# Altium schematic sheet 21_GPIOs_EXP.SchDoc
size A3; SheetNumber: 22; SheetTotal: 22
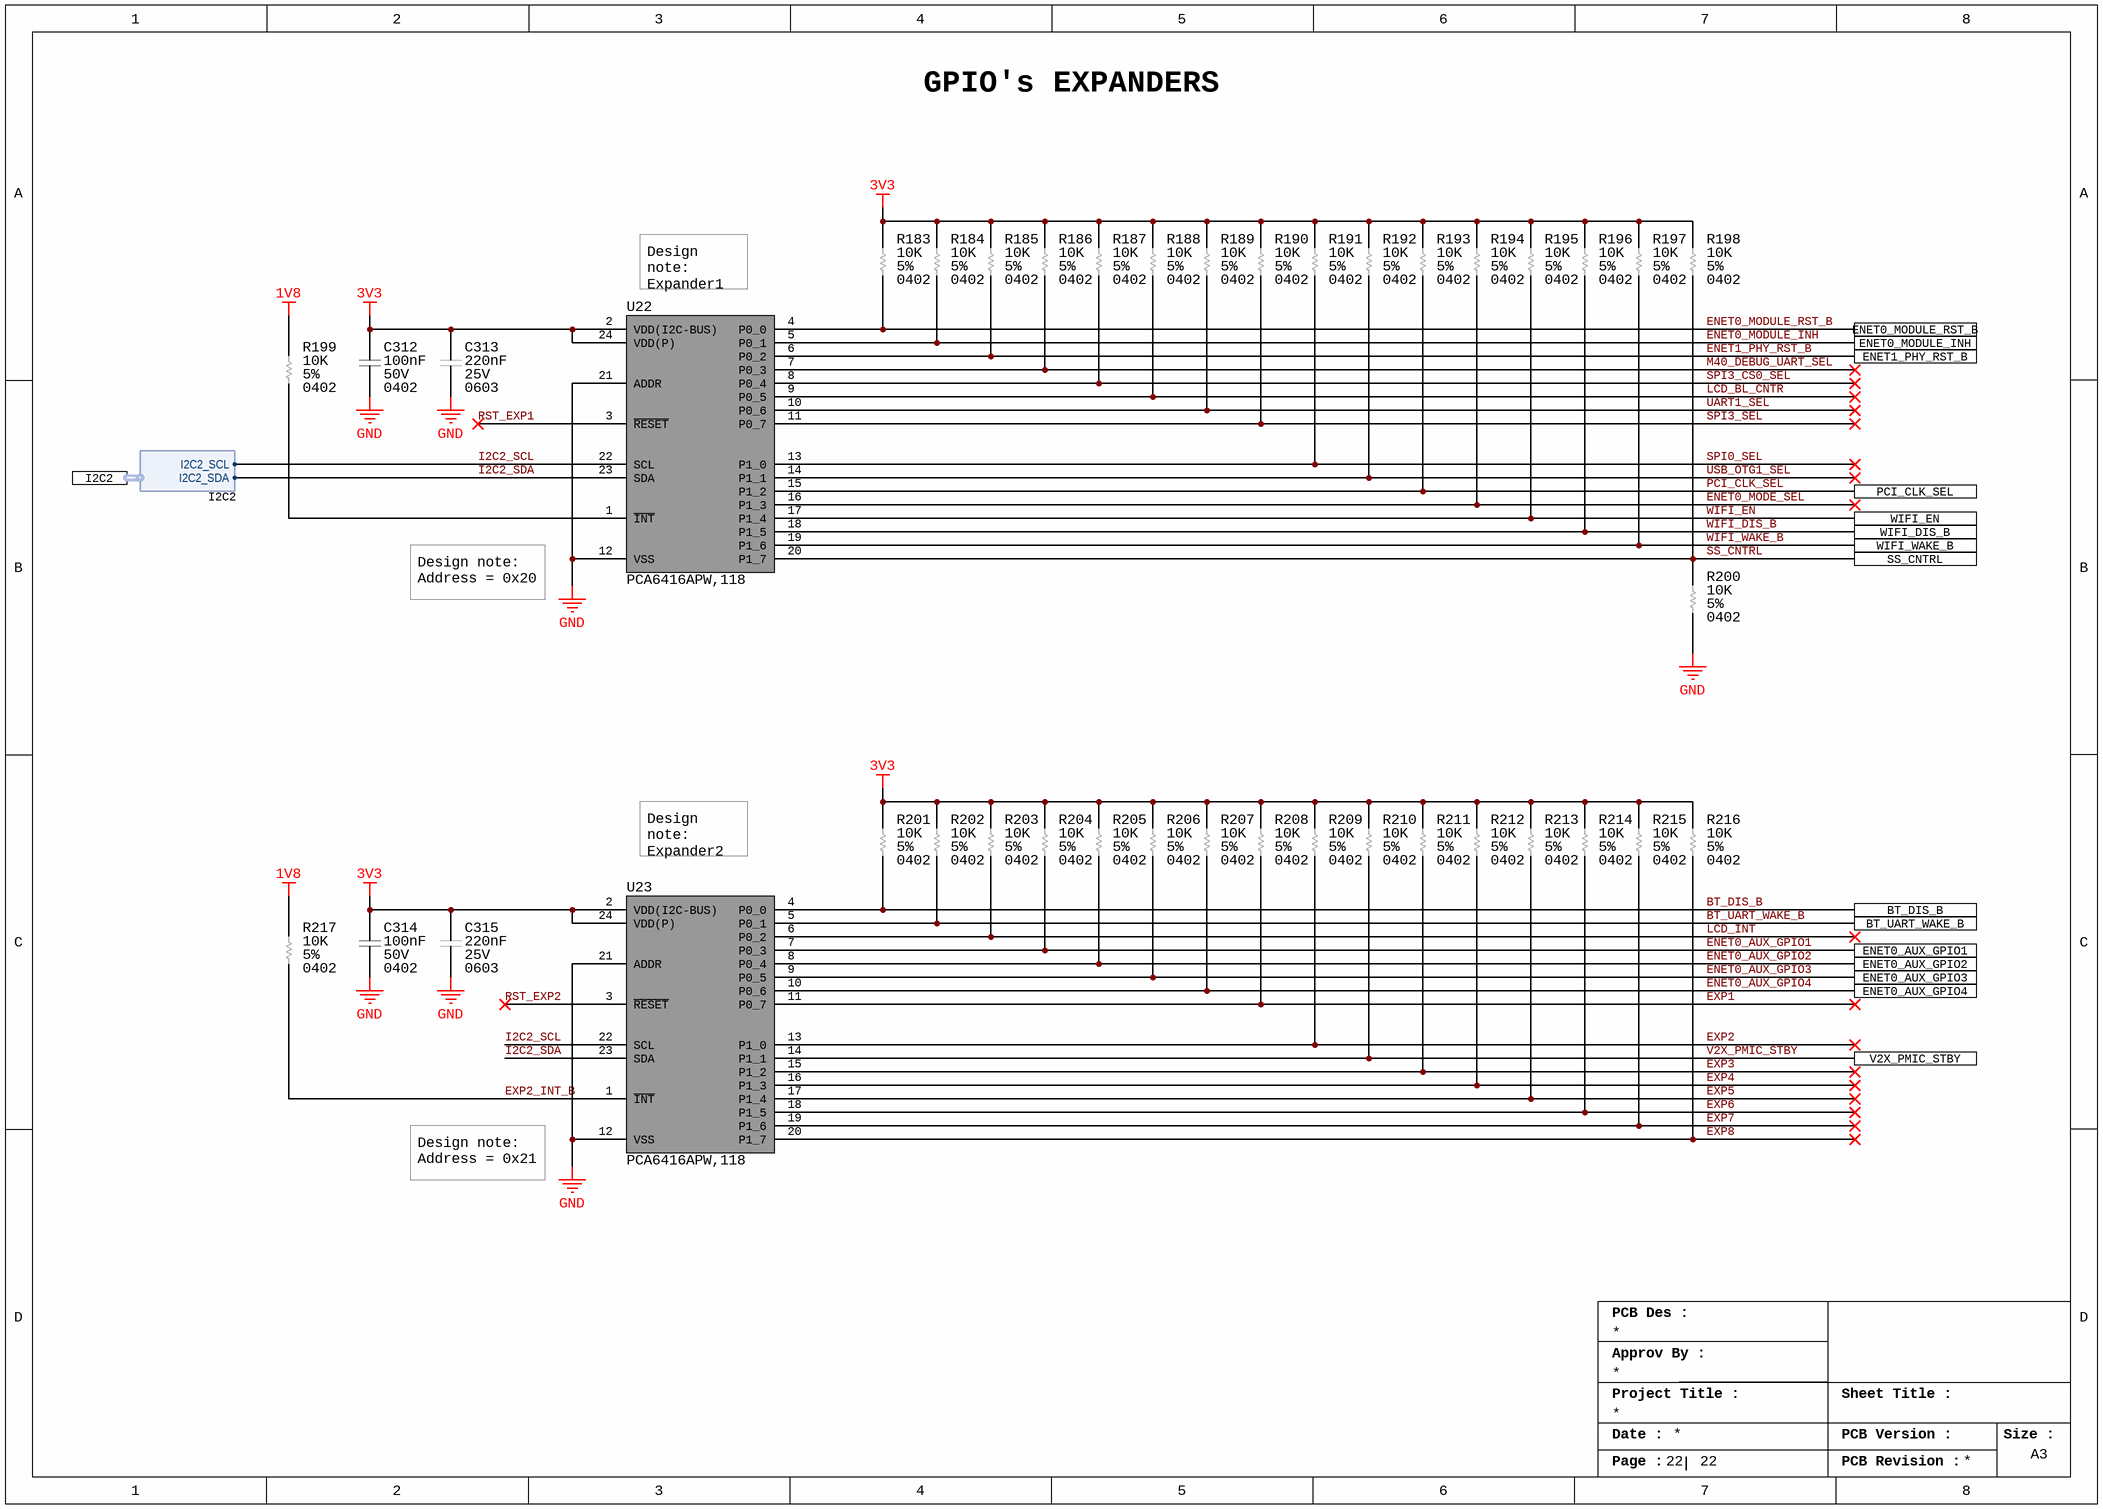
[diagram p0: 21_GPIOs_EXP.SchDoc]

## Parts
C312  Voltage Rating: 50V  Capacitance: 100nF  Case/Package: 0402  [CAP_0402_CAPC1005X05N]  (hidden comment: GRM155R71H104KE14D)
C313  Case/Package: 0603  Voltage Rating: 25V  Capacitance: 220nF  [CAP_0603_CAPC1608X08N]  (hidden comment: GRM188R71E224KA88D)
C314  Voltage Rating: 50V  Capacitance: 100nF  Case/Package: 0402  [CAP_0402_CAPC1005X05N]  (hidden comment: GRM155R71H104KE14D)
C315  Case/Package: 0603  Voltage Rating: 25V  Capacitance: 220nF  [CAP_0603_CAPC1608X08N]  (hidden comment: GRM188R71E224KA88D)
R183  Tolerance: 5%  Resistance: 10K  Case/Package: 0402  [RES_0402_RESC1005X04N]  (hidden comment: ERJ-2GEJ103X)
R184  Tolerance: 5%  Resistance: 10K  Case/Package: 0402  [RES_0402_RESC1005X04N]  (hidden comment: ERJ-2GEJ103X)
R185  Tolerance: 5%  Resistance: 10K  Case/Package: 0402  [RES_0402_RESC1005X04N]  (hidden comment: ERJ-2GEJ103X)
R186  Tolerance: 5%  Resistance: 10K  Case/Package: 0402  [RES_0402_RESC1005X04N]  (hidden comment: ERJ-2GEJ103X)
R187  Tolerance: 5%  Resistance: 10K  Case/Package: 0402  [RES_0402_RESC1005X04N]  (hidden comment: ERJ-2GEJ103X)
R188  Tolerance: 5%  Resistance: 10K  Case/Package: 0402  [RES_0402_RESC1005X04N]  (hidden comment: ERJ-2GEJ103X)
R189  Tolerance: 5%  Resistance: 10K  Case/Package: 0402  [RES_0402_RESC1005X04N]  (hidden comment: ERJ-2GEJ103X)
R190  Tolerance: 5%  Resistance: 10K  Case/Package: 0402  [RES_0402_RESC1005X04N]  (hidden comment: ERJ-2GEJ103X)
R191  Tolerance: 5%  Resistance: 10K  Case/Package: 0402  [RES_0402_RESC1005X04N]  (hidden comment: ERJ-2GEJ103X)
R192  Tolerance: 5%  Resistance: 10K  Case/Package: 0402  [RES_0402_RESC1005X04N]  (hidden comment: ERJ-2GEJ103X)
R193  Tolerance: 5%  Resistance: 10K  Case/Package: 0402  [RES_0402_RESC1005X04N]  (hidden comment: ERJ-2GEJ103X)
R194  Tolerance: 5%  Resistance: 10K  Case/Package: 0402  [RES_0402_RESC1005X04N]  (hidden comment: ERJ-2GEJ103X)
R195  Tolerance: 5%  Resistance: 10K  Case/Package: 0402  [RES_0402_RESC1005X04N]  (hidden comment: ERJ-2GEJ103X)
R196  Tolerance: 5%  Resistance: 10K  Case/Package: 0402  [RES_0402_RESC1005X04N]  (hidden comment: ERJ-2GEJ103X)
R197  Tolerance: 5%  Resistance: 10K  Case/Package: 0402  [RES_0402_RESC1005X04N]  (hidden comment: ERJ-2GEJ103X)
R198  Tolerance: 5%  Resistance: 10K  Case/Package: 0402  [RES_0402_RESC1005X04N]  (hidden comment: ERJ-2GEJ103X)
R199  Tolerance: 5%  Resistance: 10K  Case/Package: 0402  [RES_0402_RESC1005X04N]  (hidden comment: ERJ-2GEJ103X)
R200  Tolerance: 5%  Resistance: 10K  Case/Package: 0402  [RES_0402_RESC1005X04N]  (hidden comment: ERJ-2GEJ103X)
R201  Tolerance: 5%  Resistance: 10K  Case/Package: 0402  [RES_0402_RESC1005X04N]  (hidden comment: ERJ-2GEJ103X)
R202  Tolerance: 5%  Resistance: 10K  Case/Package: 0402  [RES_0402_RESC1005X04N]  (hidden comment: ERJ-2GEJ103X)
R203  Tolerance: 5%  Resistance: 10K  Case/Package: 0402  [RES_0402_RESC1005X04N]  (hidden comment: ERJ-2GEJ103X)
R204  Tolerance: 5%  Resistance: 10K  Case/Package: 0402  [RES_0402_RESC1005X04N]  (hidden comment: ERJ-2GEJ103X)
R205  Tolerance: 5%  Resistance: 10K  Case/Package: 0402  [RES_0402_RESC1005X04N]  (hidden comment: ERJ-2GEJ103X)
R206  Tolerance: 5%  Resistance: 10K  Case/Package: 0402  [RES_0402_RESC1005X04N]  (hidden comment: ERJ-2GEJ103X)
R207  Tolerance: 5%  Resistance: 10K  Case/Package: 0402  [RES_0402_RESC1005X04N]  (hidden comment: ERJ-2GEJ103X)
R208  Tolerance: 5%  Resistance: 10K  Case/Package: 0402  [RES_0402_RESC1005X04N]  (hidden comment: ERJ-2GEJ103X)
R209  Tolerance: 5%  Resistance: 10K  Case/Package: 0402  [RES_0402_RESC1005X04N]  (hidden comment: ERJ-2GEJ103X)
R210  Tolerance: 5%  Resistance: 10K  Case/Package: 0402  [RES_0402_RESC1005X04N]  (hidden comment: ERJ-2GEJ103X)
R211  Tolerance: 5%  Resistance: 10K  Case/Package: 0402  [RES_0402_RESC1005X04N]  (hidden comment: ERJ-2GEJ103X)
R212  Tolerance: 5%  Resistance: 10K  Case/Package: 0402  [RES_0402_RESC1005X04N]  (hidden comment: ERJ-2GEJ103X)
R213  Tolerance: 5%  Resistance: 10K  Case/Package: 0402  [RES_0402_RESC1005X04N]  (hidden comment: ERJ-2GEJ103X)
R214  Tolerance: 5%  Resistance: 10K  Case/Package: 0402  [RES_0402_RESC1005X04N]  (hidden comment: ERJ-2GEJ103X)
R215  Tolerance: 5%  Resistance: 10K  Case/Package: 0402  [RES_0402_RESC1005X04N]  (hidden comment: ERJ-2GEJ103X)
R216  Tolerance: 5%  Resistance: 10K  Case/Package: 0402  [RES_0402_RESC1005X04N]  (hidden comment: ERJ-2GEJ103X)
R217  Tolerance: 5%  Resistance: 10K  Case/Package: 0402  [RES_0402_RESC1005X04N]  (hidden comment: ERJ-2GEJ103X)
U22  PCA6416APW,118  [PCA6416APW118]
U23  PCA6416APW,118  [PCA6416APW118]

## Ports
BT_DIS_B, BT_UART_WAKE_B, ENET0_AUX_GPIO1, ENET0_AUX_GPIO2, ENET0_AUX_GPIO3, ENET0_AUX_GPIO4, ENET0_MODULE_INH, ENET0_MODULE_RST_B, ENET1_PHY_RST_B, I2C2 (harness I2C2), PCI_CLK_SEL, SS_CNTRL, V2X_PMIC_STBY, WIFI_DIS_B, WIFI_EN, WIFI_WAKE_B

## Harnesses
I2C2: I2C2_SDA, I2C2_SCL

## Nets
1V8: R199.2 R217.2
3V3: C312.2 C313.2 C314.2 C315.2 R183.2 R184.2 R185.2 R186.2 R187.2 R188.2 R189.2 R190.2 R191.2 R192.2 R193.2 R194.2 R195.2 R196.2 R197.2 R198.2 R201.2 R202.2 R203.2 R204.2 R205.2 R206.2 R207.2 R208.2 R209.2 R210.2 R211.2 R212.2 R213.2 R214.2 R215.2 R216.2 U22.2(VDD(I2C-BUS)) U22.24(VDD(P)) U23.2(VDD(I2C-BUS)) U23.24(VDD(P))
GND: C312.1 C313.1 C314.1 C315.1 R200.1 U22.12(VSS) U22.21(ADDR) U23.12(VSS) U23.21(ADDR)
BT_DIS_B: R201.1 U23.4(P0_0) ; port BT_DIS_B
BT_UART_WAKE_B: R202.1 U23.5(P0_1) ; port BT_UART_WAKE_B
ENET0_AUX_GPIO1: R204.1 U23.7(P0_3) ; port ENET0_AUX_GPIO1
ENET0_AUX_GPIO2: R205.1 U23.8(P0_4) ; port ENET0_AUX_GPIO2
ENET0_AUX_GPIO3: R206.1 U23.9(P0_5) ; port ENET0_AUX_GPIO3
ENET0_AUX_GPIO4: R207.1 U23.10(P0_6) ; port ENET0_AUX_GPIO4
ENET0_MODE_SEL: R194.1 U22.16(P1_3)
ENET0_MODULE_INH: R184.1 U22.5(P0_1) ; port ENET0_MODULE_INH
ENET0_MODULE_RST_B: R183.1 U22.4(P0_0) ; port ENET0_MODULE_RST_B
ENET1_PHY_RST_B: R185.1 U22.6(P0_2) ; port ENET1_PHY_RST_B
EXP1: R208.1 U23.11(P0_7)
EXP2: R209.1 U23.13(P1_0)
EXP2_INT_B: R217.1 U23.1(~{INT})
EXP3: R211.1 U23.15(P1_2)
EXP4: R212.1 U23.16(P1_3)
EXP5: R213.1 U23.17(P1_4)
EXP6: R214.1 U23.18(P1_5)
EXP7: R215.1 U23.19(P1_6)
EXP8: R216.1 U23.20(P1_7)
I2C2_SCL: U22.22(SCL) U23.22(SCL) ; port I2C2.I2C2_SCL
I2C2_SDA: U22.23(SDA) U23.23(SDA) ; port I2C2.I2C2_SDA
LCD_BL_CNTR: R188.1 U22.9(P0_5)
LCD_INT: R203.1 U23.6(P0_2)
M40_DEBUG_UART_SEL: R186.1 U22.7(P0_3)
PCI_CLK_SEL: R193.1 U22.15(P1_2) ; port PCI_CLK_SEL
RST_EXP1: U22.3(~{RESET})
RST_EXP2: U23.3(~{RESET})
SPI0_SEL: R191.1 U22.13(P1_0)
SPI3_CS0_SEL: R187.1 U22.8(P0_4)
SPI3_SEL: R190.1 U22.11(P0_7)
SS_CNTRL: R198.1 R200.2 U22.20(P1_7) ; port SS_CNTRL
UART1_SEL: R189.1 U22.10(P0_6)
USB_OTG1_SEL: R192.1 U22.14(P1_1)
V2X_PMIC_STBY: R210.1 U23.14(P1_1) ; port V2X_PMIC_STBY
WIFI_DIS_B: R196.1 U22.18(P1_5) ; port WIFI_DIS_B
WIFI_EN: R195.1 U22.17(P1_4) ; port WIFI_EN
WIFI_WAKE_B: R197.1 U22.19(P1_6) ; port WIFI_WAKE_B
NetR199_1: R199.1 U22.1(~{INT})

## Notes on the sheet
- GPIO's EXPANDERS
- (near U22) Design note:
  Expander1
- Design note:
  Address = 0x20
- Design note:
  Expander2
- Design note:
  Address = 0x21
- PCB Des :
- Approv By :
- Project Title :
- Sheet Title :
- Date :
- PCB Version :
- Size :
- A3
- Page :
- PCB Revision :

## Library data of the parts
C312 C314 = CAP_100NF_50V_X7R_0402: Multilayer Ceramic Capacitor, 0.1 uF, 16 V, ± 10%, X7R, 0402 [1005 Metric]; Manufacturer: Murata; Dissipation Factor: 0.025%; Temperature Coefficient: 30ppm/°C; Supplier 1: DigiKey; Manufacturer Part Number: GRM155R71H104KE14D; RoHS: Yes; Category: Ceramic Capacitors; Stock 1: 13730790; Pricing 1: 1=0.1, 10=0.023, 50=0.0132, 100=0.0102, 500=0.00768, 1000=0.00603, 2500=0.00548, 5000=0.00504 (USD); Mount: Surface Mount; Number of Pins: 2NUMBER; Case Code (Metric): 1005; Material: Ceramic; Case Code (Imperial): 0402; Weight: 0.000212oz; Dielectric Material: Ceramic; Min Operating Temperature: -55°C; Max Operating Temperature: 125°C; Packaging: Tape and Reel; Package Quantity: 10000; Series: GRM; Tolerance: 10%; Dielectric: X7R; Termination: SMD/SMT; Voltage: 50V; Voltage Rating (DC): 50V; Construction: Flat; Length: 1mm; Width: 0.5mm; Height: 0.5mm; Depth: 0.5mm; Thickness: 0.022inch; Reach SVHC Compliant: No; RoHS Compliant: Yes; Lead Free: 5697LeadFree; ComponentLink1URL: http://www.farnell.com/datasheets/2079156.pdf?src-supplier=Farnell; ComponentLink1Description: http://www.farnell.com/datasheets/2079156.pdf?src-supplier=Farnell; ComponentLink2URL: http://www.mouser.com/ds/2/281/c02e-2905.pdf?src-supplier=Mouser; ComponentLink2Description: http://www.mouser.com/ds/2/281/c02e-2905.pdf?src-supplier=Mouser; ComponentLink3URL: http://www.farnell.com/datasheets/2079156.pdf?src-supplier=Newark; ComponentLink3Description: http://www.farnell.com/datasheets/2079156.pdf?src-supplier=Newark; ComponentLink4URL: https://datasheet.octopart.com/GRM155R71H104KE14D-Murata-datasheet-22122223.pdf?src-supplier=Future+Electronics; ComponentLink4Description: https://datasheet.octopart.com/GRM155R71H104KE14D-Murata-datasheet-22122223.pdf?src-supplier=Future+Electronics; ComponentLink5URL: https://search.murata.co.jp/Ceramy/image/img/A01X/G101/ENG/GRM155R71H104KE14-01.pdf?src-supplier=Digi-Key; ComponentLink5Description: https://search.murata.co.jp/Ceramy/image/img/A01X/G101/ENG/GRM155R71H104KE14-01.pdf?src-supplier=Digi-Key; ComponentLink6URL: http://psearch.en.murata.com/capacitor/product/GRM155R71H104KE14%23.pdf?src-supplier=Avnet; ComponentLink6Description: http://psearch.en.murata.com/capacitor/product/GRM155R71H104KE14%23.pdf?src-supplier=Avnet; ComponentLink7URL: https://datasheet.octopart.com/GRM155R71H104KE14D-Murata-datasheet-66077078.pdf?src-supplier=Element14; ComponentLink7Description: https://datasheet.octopart.com/GRM155R71H104KE14D-Murata-datasheet-66077078.pdf?src-supplier=Element14; Supplier Part Number 1: 490-10700-6-ND; Supplier 2: Digikey; Stock 2: 3706055; Pricing 2: 1=0.1, 10=0.037, 50=0.021, 100=0.0162, 500=0.01224, 1000=0.00961, 2500=0.00874, 5000=0.00804 (USD); Halogen Free: 5694HalogenFree; ComponentLink8URL: http://www.mouser.com/ds/2/447/UPY-GPHC_X5R_4V-to-50V_25-1131599.pdf?src-supplier=Mouser; ComponentLink8Description: http://www.mouser.com/ds/2/447/UPY-GPHC_X5R_4V-to-50V_25-1131599.pdf?src-supplier=Mouser; ComponentLink9URL: https://datasheet.octopart.com/CC0402KRX5R8BB104-Yageo-datasheet-137700082.pdf?src-supplier=Future+Electronics; ComponentLink9Description: https://datasheet.octopart.com/CC0402KRX5R8BB104-Yageo-datasheet-137700082.pdf?src-supplier=Future+Electronics; ComponentLink10URL: http://www.yageo.com/documents/recent/UPY-GPHC_X5R_4V-to-50V_25.pdf?src-supplier=Digikey; ComponentLink10Description: http://www.yageo.com/documents/recent/UPY-GPHC_X5R_4V-to-50V_25.pdf?src-supplier=Digikey; ComponentLink11URL: https://datasheet.octopart.com/CC0402KRX5R8BB104-Yageo-datasheet-140260304.pdf?src-supplier=Newark; ComponentLink11Description: https://datasheet.octopart.com/CC0402KRX5R8BB104-Yageo-datasheet-140260304.pdf?src-supplier=Newark; ComponentLink12URL: https://datasheet.octopart.com/CC0402KRX5R8BB104-Yageo-datasheet-170350636.pdf?src-supplier=Future+Electronics; ComponentLink12Description: https://datasheet.octopart.com/CC0402KRX5R8BB104-Yageo-datasheet-170350636.pdf?src-supplier=Future+Electronics; ComponentLink13URL: http://www.yageo.com/documents/recent/UPY-GPHC_X5R_4V-to-50V-16.pdf?src-supplier=Future+Electronics; ComponentLink13Description: http://www.yageo.com/documents/recent/UPY-GPHC_X5R_4V-to-50V-16.pdf?src-supplier=Future+Electronics; Supplier Part Number 2: 311-1697-1-ND
C313 C315 = CAP_0.22uF_25V_X7R_0603: Multilayer Ceramic Capacitor, 0.22 uF, 25 V, ± 10%, X7R, 0603 [1608 Metric]; Manufacturer: Murata; Voltage: 50V; Supplier 1: Mouser; Manufacturer Part Number: GRM188R71E224KA88D; RoHS: Yes; Category: Ceramic Capacitors; Stock 1: 86605; Pricing 1: 1=0.1, 10=0.036, 50=0.036, 100=0.021, 1000=0.019, 10000=0.012 (USD); Mount: Surface Mount; Number of Pins: 2; Case Code (Imperial): 0603; Case Code (Metric): 1608; Material: Ceramic; Min Operating Temperature: -55°C; Max Operating Temperature: 125°C; Tolerance: 10%; Dielectric: X7R; Voltage Rating (DC): 25V; Packaging: Tape and Reel; Package Quantity: 1; Termination: SMD/SMT; Series: GRM; Construction: Flat; Length: 1.6mm; Width: 0.031inch; Height: 0.8mm; Thickness: 0.035inch; Depth: 0.8mm; Radiation Hardening: No; Reach SVHC Compliant: No; RoHS Compliant: Yes; Lead Free: 5697LeadFree; ComponentLink1URL: https://datasheet.ciiva.com/133/grm188r71e224ka88-01-133883.pdf?src-supplier=Digi-Key; ComponentLink1Description: https://datasheet.ciiva.com/133/grm188r71e224ka88-01-133883.pdf?src-supplier=Digi-Key; ComponentLink2URL: https://datasheet.ciiva.com/133/grm188r71e224ka88-01-133884.pdf?src-supplier=Digi-Key; ComponentLink2Description: https://datasheet.ciiva.com/133/grm188r71e224ka88-01-133884.pdf?src-supplier=Digi-Key; ComponentLink3URL: https://datasheet.ciiva.com/5411/product-5411362.pdf?src-supplier=Mouser; ComponentLink3Description: https://datasheet.ciiva.com/5411/product-5411362.pdf?src-supplier=Mouser; ComponentLink4URL: https://datasheet.ciiva.com/11786/0900766b807a1cab-11786308.pdf?src-supplier=Rs; ComponentLink4Description: https://datasheet.ciiva.com/11786/0900766b807a1cab-11786308.pdf?src-supplier=Rs; ComponentLink5URL: https://datasheet.ciiva.com/6068/1784408-6068393.pdf?src-supplier=Farnell; ComponentLink5Description: https://datasheet.ciiva.com/6068/1784408-6068393.pdf?src-supplier=Farnell; ComponentLink6URL: https://datasheet.ciiva.com/3777/1531grm188r71e224ka8823-3777688.pdf?src-supplier=Arrow+Electronics; ComponentLink6Description: https://datasheet.ciiva.com/3777/1531grm188r71e224ka8823-3777688.pdf?src-supplier=Arrow+Electronics; ComponentLink7URL: https://datasheet.ciiva.com/29202/451619-da-01-en-vs-kondensator-0603-29202002.pdf?src-supplier=Conrad; ComponentLink7Description: https://datasheet.ciiva.com/29202/451619-da-01-en-vs-kondensator-0603-29202002.pdf?src-supplier=Conrad; ComponentLink8URL: https://datasheet.ciiva.com/48436/nmgrm-data-en-48436687.pdf?src-supplier=Distrelec; ComponentLink8Description: https://datasheet.ciiva.com/48436/nmgrm-data-en-48436687.pdf?src-supplier=Distrelec; ComponentLink9URL: https://datasheet.ciiva.com/14116/nmgrm-data-en-14116629.pdf?src-supplier=Distrelec; ComponentLink9Description: https://datasheet.ciiva.com/14116/nmgrm-data-en-14116629.pdf?src-supplier=Distrelec; ComponentLink10URL: https://datasheet.ciiva.com/16425/product-16425866.pdf?src-supplier=Future+Electronics; ComponentLink10Description: https://datasheet.ciiva.com/16425/product-16425866.pdf?src-supplier=Future+Electronics; ComponentLink11URL: https://datasheet.ciiva.com/22703/1784408-22703338.pdf?src-supplier=Element14; ComponentLink11Description: https://datasheet.ciiva.com/22703/1784408-22703338.pdf?src-supplier=Element14; ComponentLink12URL: https://datasheet.ciiva.com/7937/1784408-7937645.pdf?src-supplier=Element14; ComponentLink12Description: https://datasheet.ciiva.com/7937/1784408-7937645.pdf?src-supplier=Element14; Supplier Part Number 1: 81-GRM188R71E224KA88
R183-R217 = RES_10K_5%_100mW_0402: Res Thick Film 0402 10K Ohm 5% 1/10W ±200ppm/°C Molded SMD Punched Carrier T/R; Manufacturer: Panasonic; Power Rating: 100mW; Voltage Rating: 50V; Supplier 1: Digi-Key; Manufacturer Part Number: ERJ-2GEJ103X; RoHS: Yes; Category: Chip SMD Resistors; Stock 1: 4696986; Pricing 1: 1=0.1, 10=0.021, 50=0.0132, 100=0.011, 500=0.00744, 1000=0.00639, 5000=0.00464 (USD); Mount: Surface Mount; Contact Plating: Tin; Case Code (Metric): 1005; Case Code (Imperial): 0402; Size Code: 0402; Min Operating Temperature: -55°C; Max Operating Temperature: 155°C; Temperature Coefficient: 200ppm/°C; Packaging: Cut Tape; Resistor Type: Thick Film; Package Quantity: 10000; Number of Terminations: 2; Termination: SMD/SMT; Max Power Dissipation: 100mW; Features: Automotive AEC-Q200; Series: ERJ; Resistance Tolerance: 5%; Technology: THICK FILM; Voltage Rating (DC): 50V; Length: 1mm; Width: 0.5mm; Height: 0.35mm; Depth: 0.5mm; Ratings: AEC-Q200; Radiation Hardening: No; Reach SVHC Compliant: No; RoHS Compliant: Yes; Lead Free: 5697LeadFree; ComponentLink1URL: https://datasheet.ciiva.com/27055/1935721-27055112.pdf?src-supplier=Jameco; ComponentLink1Description: https://datasheet.ciiva.com/27055/1935721-27055112.pdf?src-supplier=Jameco; ComponentLink2URL: https://datasheet.ciiva.com/11821/0900766b80f806dd-11821170.pdf?src-supplier=Rs; ComponentLink2Description: https://datasheet.ciiva.com/11821/0900766b80f806dd-11821170.pdf?src-supplier=Rs; ComponentLink3URL: https://datasheet.ciiva.com/43460/1678796-43460391.pdf?src-supplier=Farnell; ComponentLink3Description: https://datasheet.ciiva.com/43460/1678796-43460391.pdf?src-supplier=Farnell; ComponentLink4URL: https://datasheet.ciiva.com/22785/1678796-22785949.pdf?src-supplier=Farnell; ComponentLink4Description: https://datasheet.ciiva.com/22785/1678796-22785949.pdf?src-supplier=Farnell; ComponentLink5URL: https://datasheet.ciiva.com/46371/1678796-46371910.pdf?src-supplier=Element14; ComponentLink5Description: https://datasheet.ciiva.com/46371/1678796-46371910.pdf?src-supplier=Element14; ComponentLink6URL: https://datasheet.ciiva.com/28514/1678796-28514154.pdf?src-supplier=Element14; ComponentLink6Description: https://datasheet.ciiva.com/28514/1678796-28514154.pdf?src-supplier=Element14; ComponentLink7URL: https://datasheet.ciiva.com/24070/aoa0000ce1-37422-24070679.pdf?src-supplier=Mouser; ComponentLink7Description: https://datasheet.ciiva.com/24070/aoa0000ce1-37422-24070679.pdf?src-supplier=Mouser; ComponentLink8URL: https://datasheet.ciiva.com/16767/70260739-16767130.pdf?src-supplier=Allied+Electronics; ComponentLink8Description: https://datasheet.ciiva.com/16767/70260739-16767130.pdf?src-supplier=Allied+Electronics; ComponentLink9URL: https://datasheet.ciiva.com/16774/70260739-16774504.pdf?src-supplier=Allied+Electronics; ComponentLink9Description: https://datasheet.ciiva.com/16774/70260739-16774504.pdf?src-supplier=Allied+Electronics; ComponentLink10URL: https://datasheet.ciiva.com/9194/aoa0000ce1-9194140.pdf?src-supplier=Avnet; ComponentLink10Description: https://datasheet.ciiva.com/9194/aoa0000ce1-9194140.pdf?src-supplier=Avnet; Supplier Part Number 1: P10KJCT-ND
U22 U23 = IC_EXPANDER_16_PCA6416APW,118: I2C/SMBus Interface 100kHz/400kHz 5.5V 24-Pin TSSOP T/R; Manufacturer: NXP Semiconductors; Number of Channels: 1; Output Current: 10mA; Interface: I2C,SMBus; Operating Supply Current: 200mA; Max Frequency: 100kHz; Frequency: 400kHz; Number of I/Os: 16; Supplier 1: Verical; Manufacturer Part Number: PCA6416APW,118; RoHS: Yes; Category: Interface ICs; Stock 1: 2500; Pricing 1: 2500=0.7457, 5000=0.7272, 7500=0.7138, 12500=0.6896 (USD); Mount: Surface Mount; Case/Package: TSSOP; Number of Pins: 24; Weight: 0.007478oz; Min Operating Temperature: -40°C; Max Operating Temperature: 85°C; Operating Supply Voltage: 5.5V; Packaging: Tape and Reel; Package Quantity: 1; Series: -; Supply Voltage-Nom: 5.5V; Supply Current: 200mA; Lead Free: Lead Free; RoHS Compliant: Yes; ComponentLink1URL: https://datasheet.ciiva.com/12097/pca6416a-211613-12097269.pdf?src-supplier=Mouser; ComponentLink1Description: https://datasheet.ciiva.com/12097/pca6416a-211613-12097269.pdf?src-supplier=Mouser; ComponentLink2URL: https://datasheet.ciiva.com/16297/pca6416a-16297873.pdf?src-supplier=Future+Electronics; ComponentLink2Description: https://datasheet.ciiva.com/16297/pca6416a-16297873.pdf?src-supplier=Future+Electronics; ComponentLink3URL: https://datasheet.ciiva.com/6633/pca6416a-6633197.pdf?src-supplier=Digikey; ComponentLink3Description: https://datasheet.ciiva.com/6633/pca6416a-6633197.pdf?src-supplier=Digikey; ComponentLink4URL: https://datasheet.ciiva.com/6633/pca6416a-6633198.pdf?src-supplier=Digikey; ComponentLink4Description: https://datasheet.ciiva.com/6633/pca6416a-6633198.pdf?src-supplier=Digikey; ComponentLink5URL: https://datasheet.ciiva.com/6633/pca6416a-6633199.pdf?src-supplier=Digikey; ComponentLink5Description: https://datasheet.ciiva.com/6633/pca6416a-6633199.pdf?src-supplier=Digikey; Supplier Part Number 1: PCA6416APW,118